# Altium project CONTROLLER.PrjPcb (part 1 of 2)
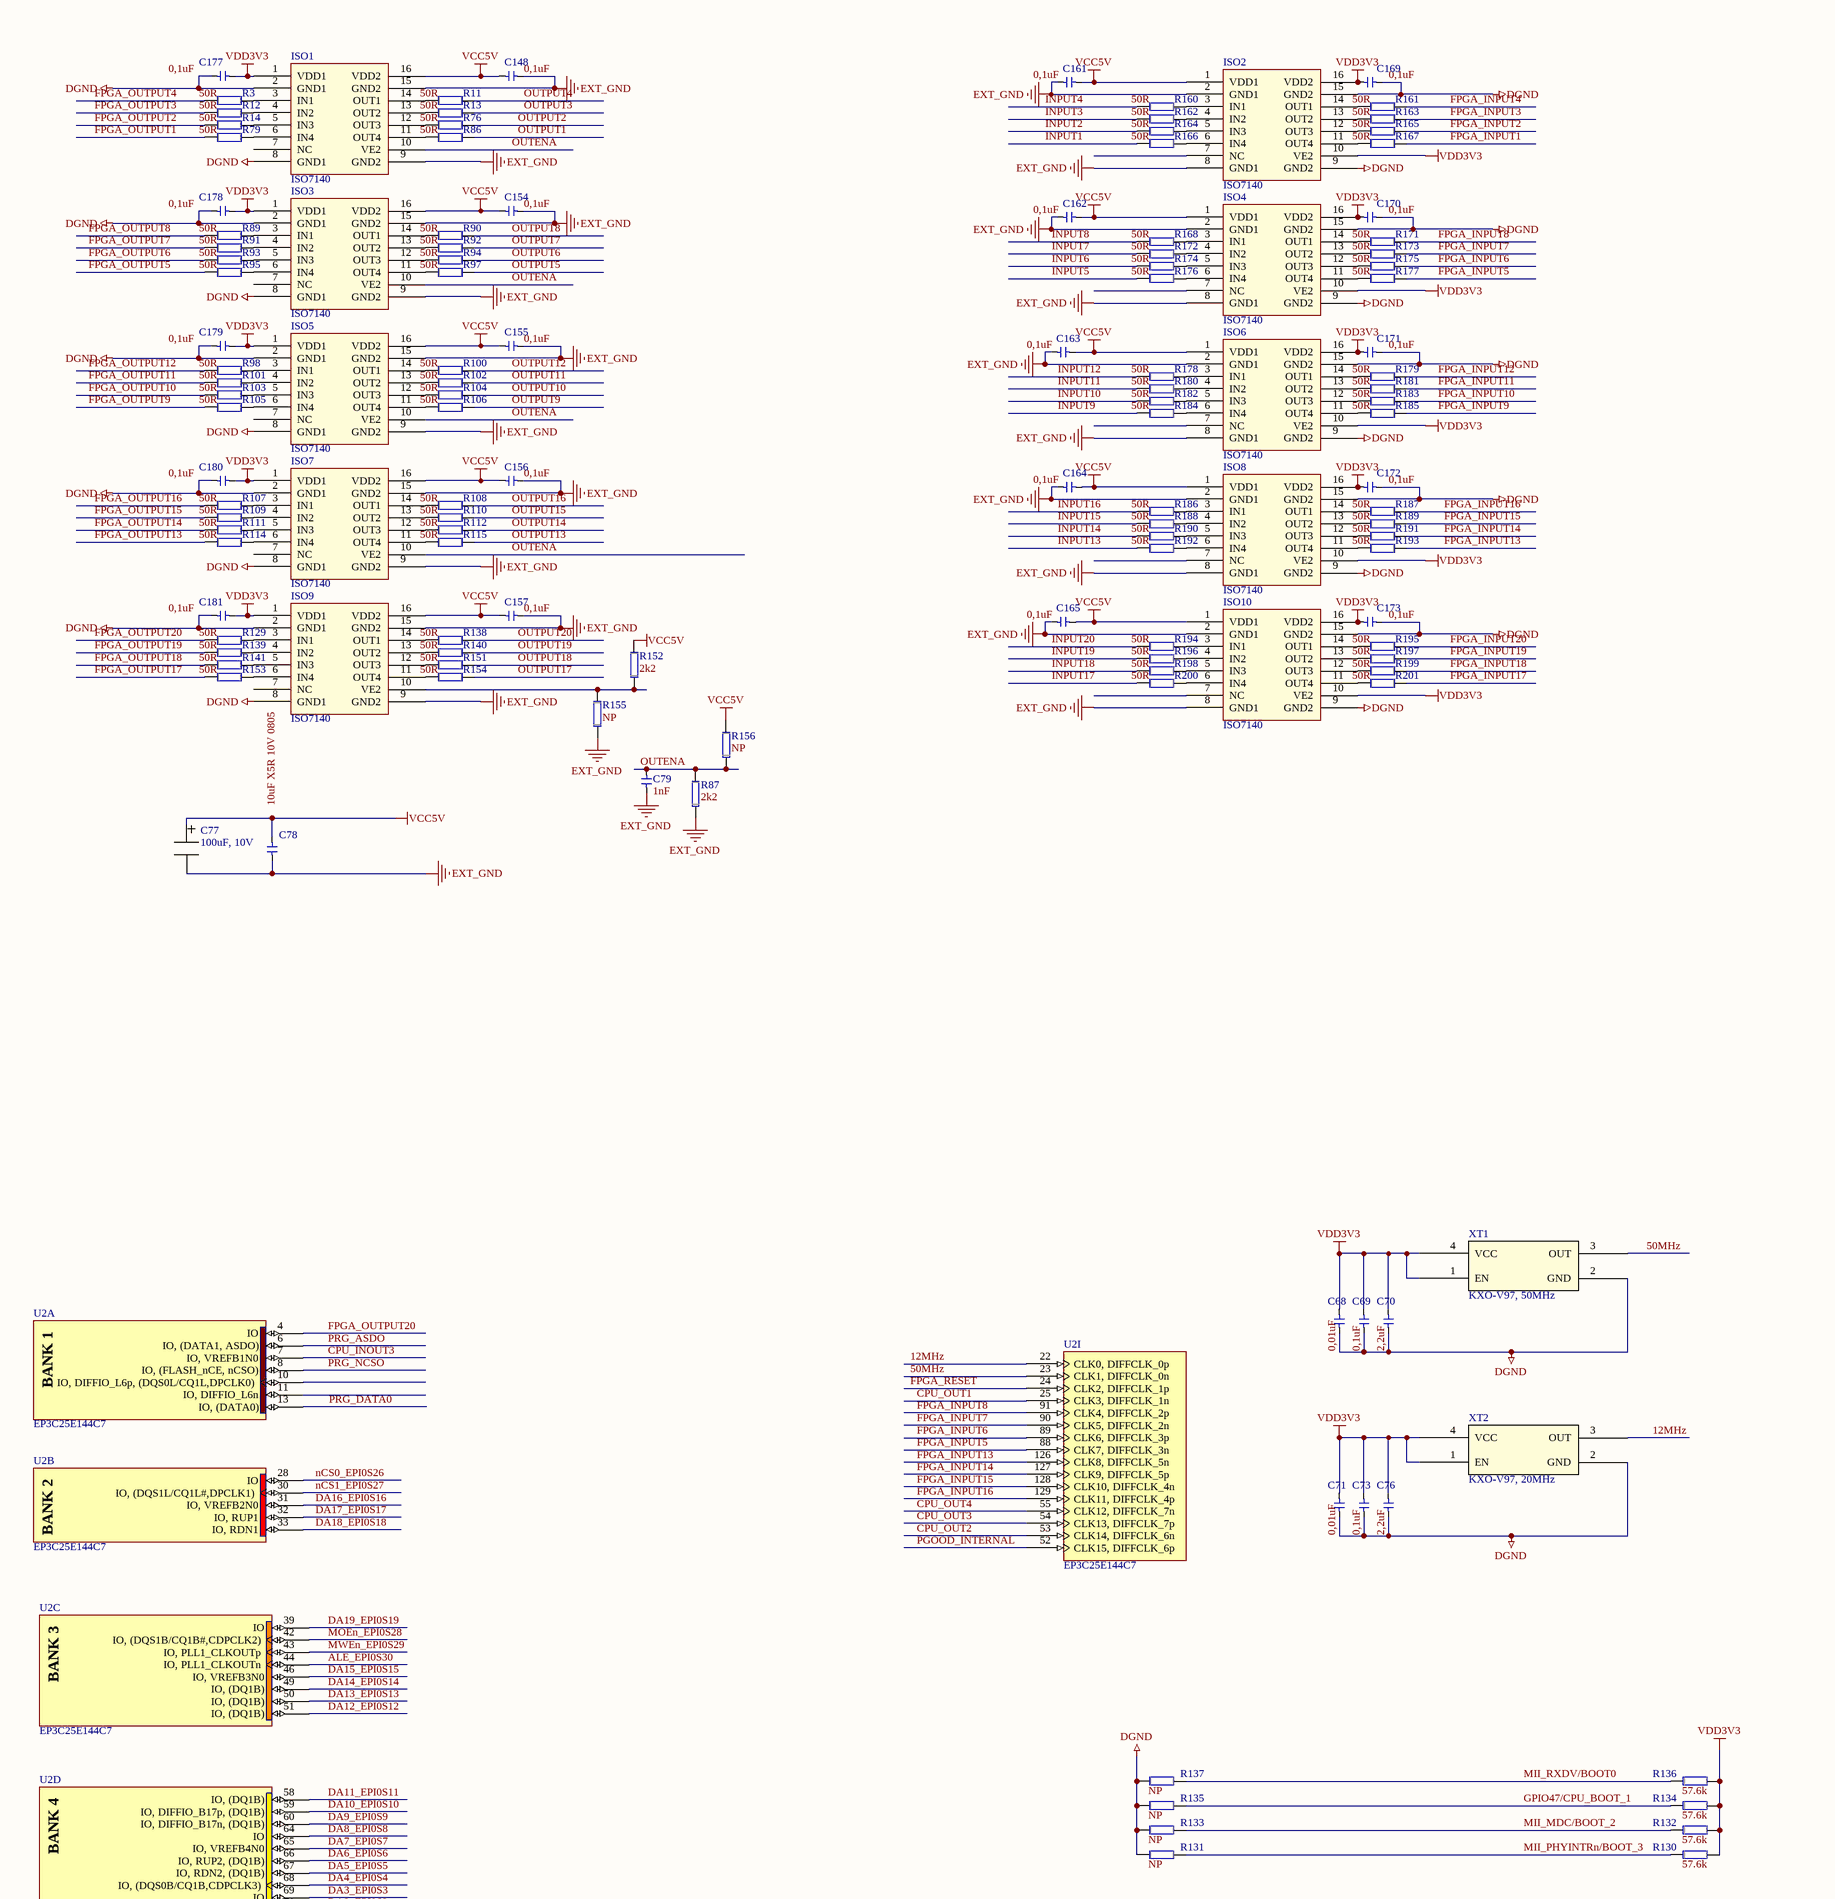
[diagram p0: CONTROLLER.SchDoc, top left]
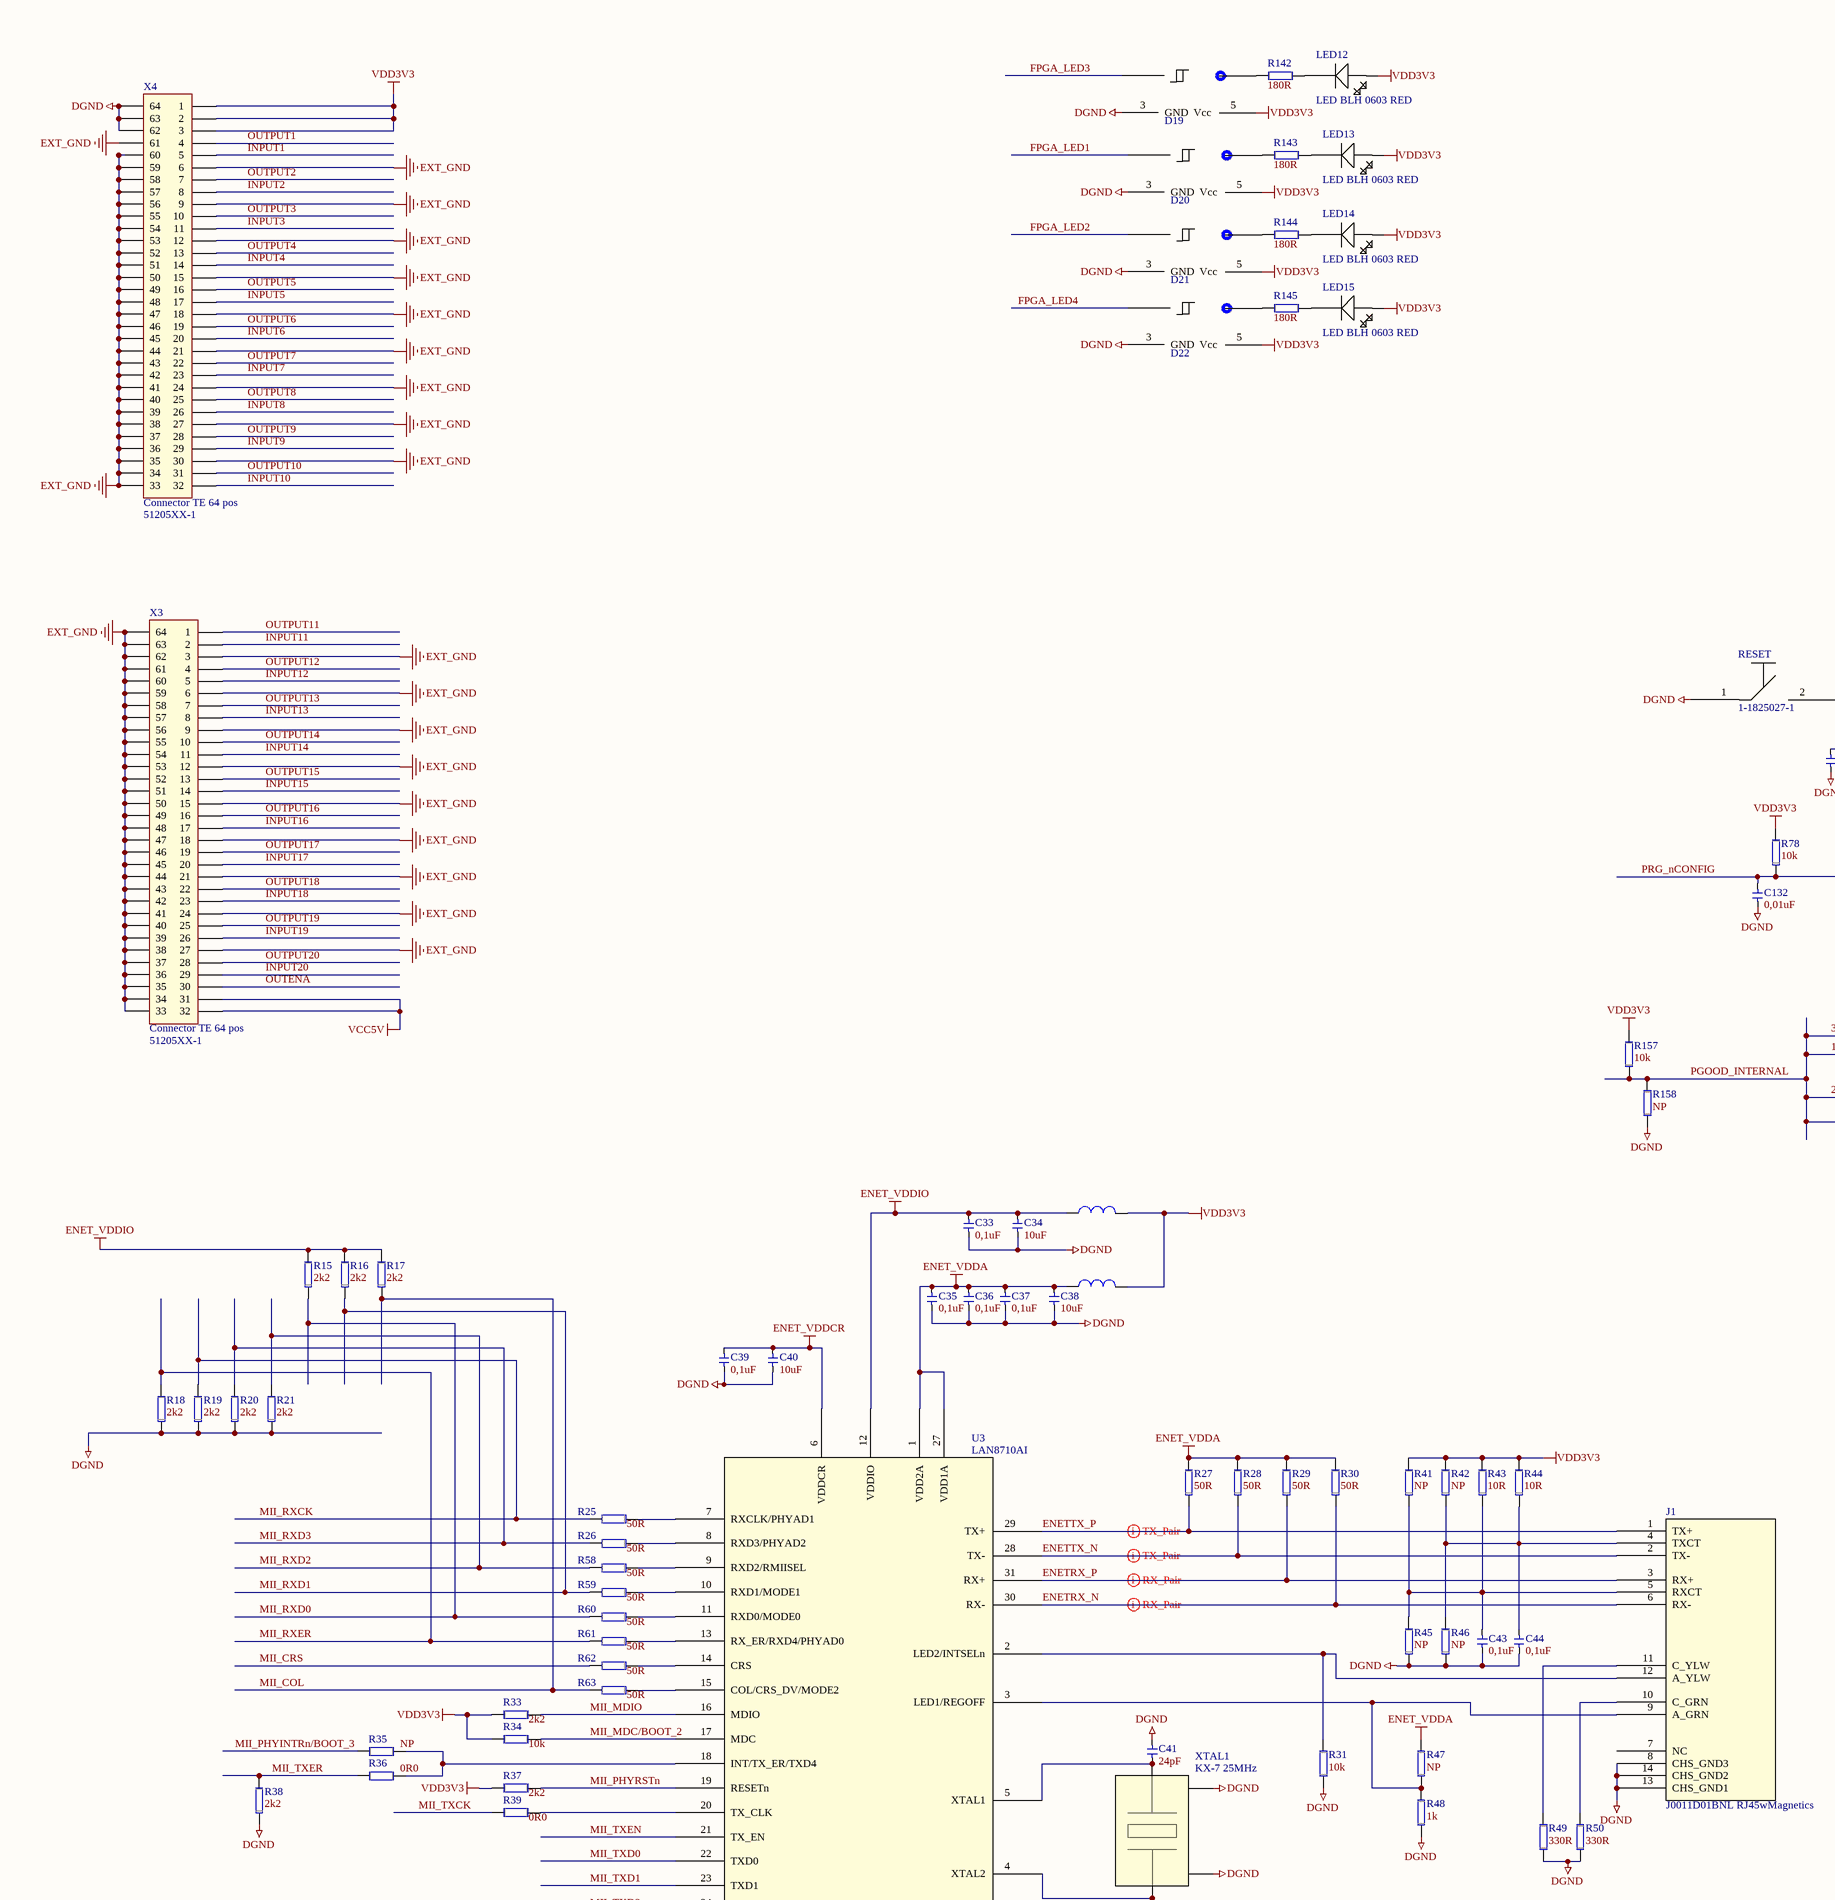
[diagram p1: CONTROLLER.SchDoc, top middle]
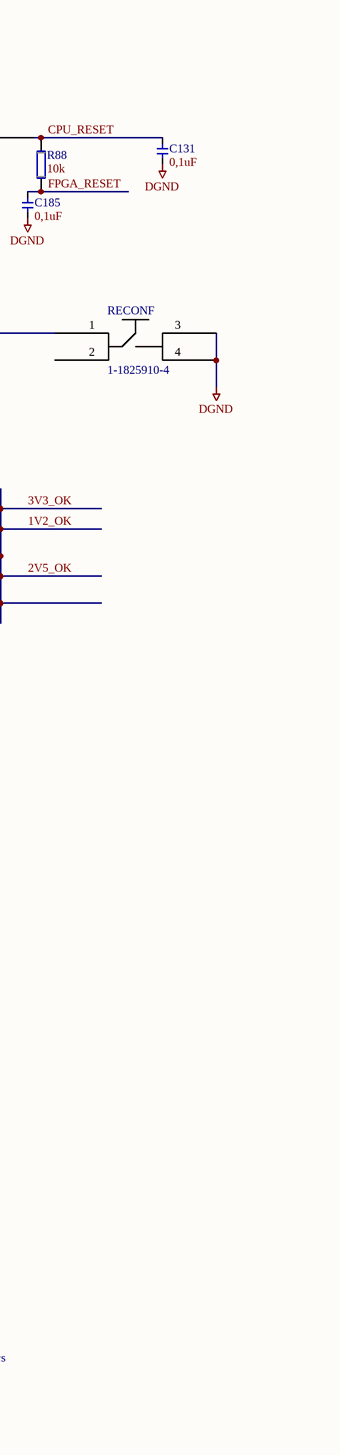
[diagram p2: CONTROLLER.SchDoc, top right]
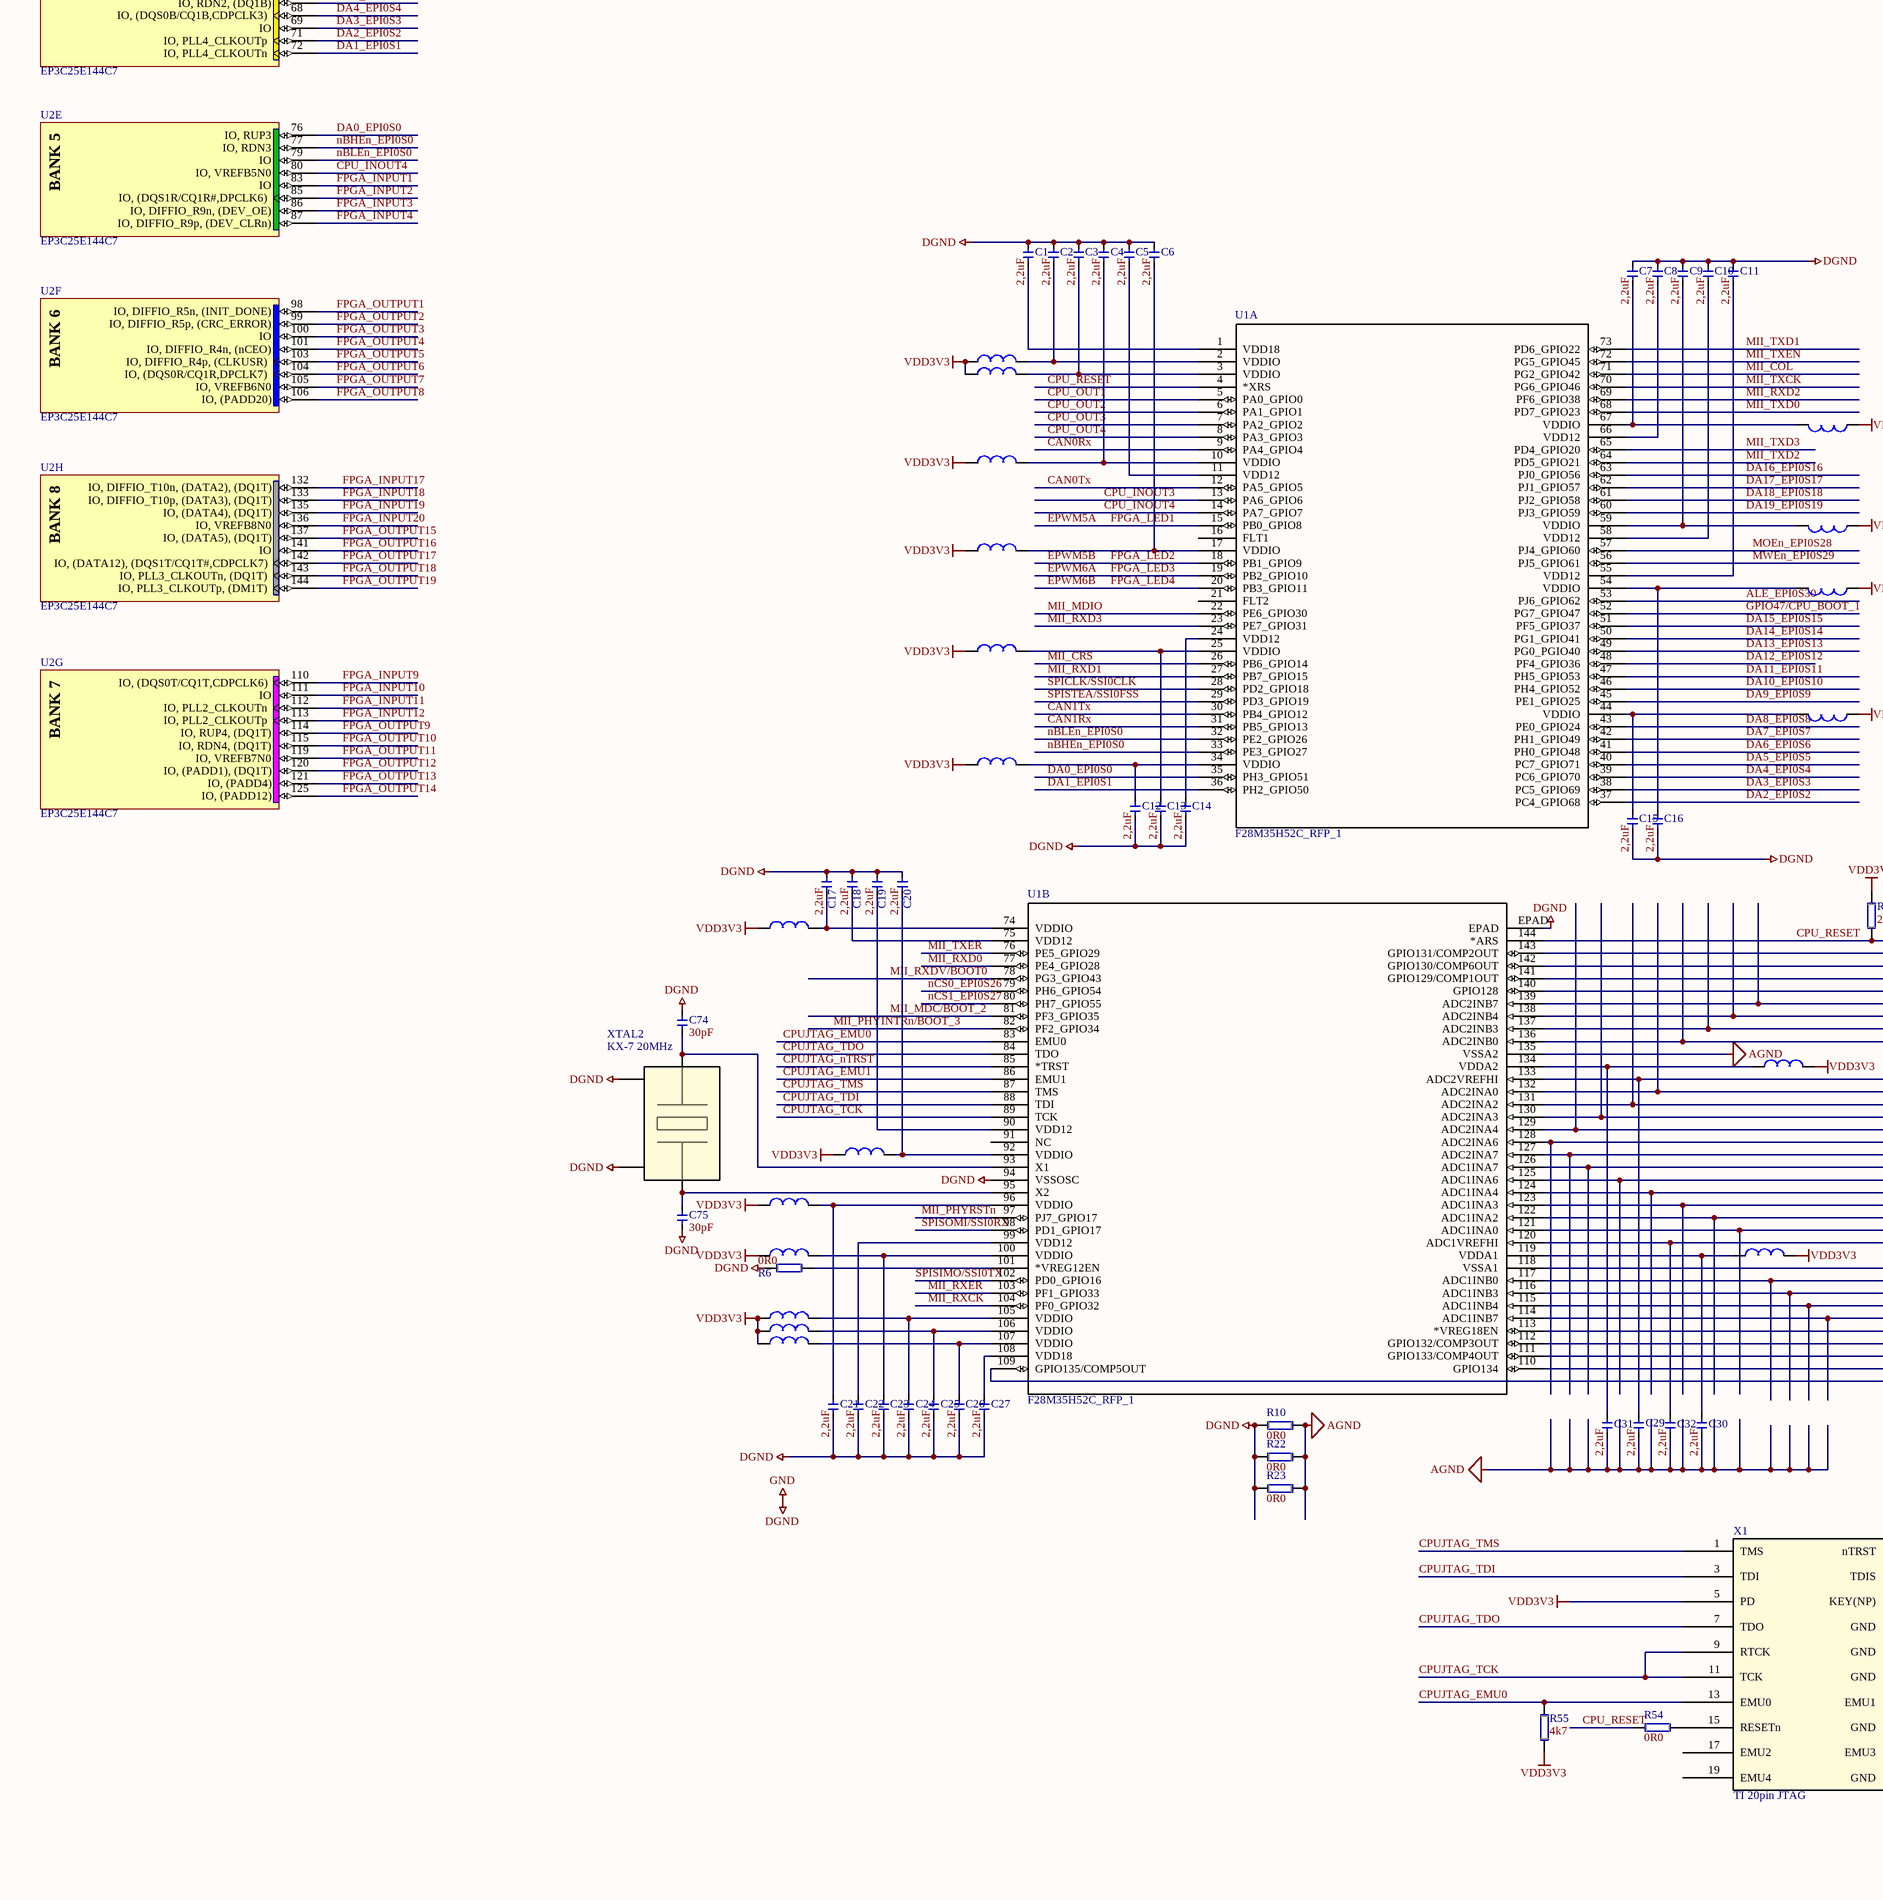
[diagram p3: CONTROLLER.SchDoc, bottom left]
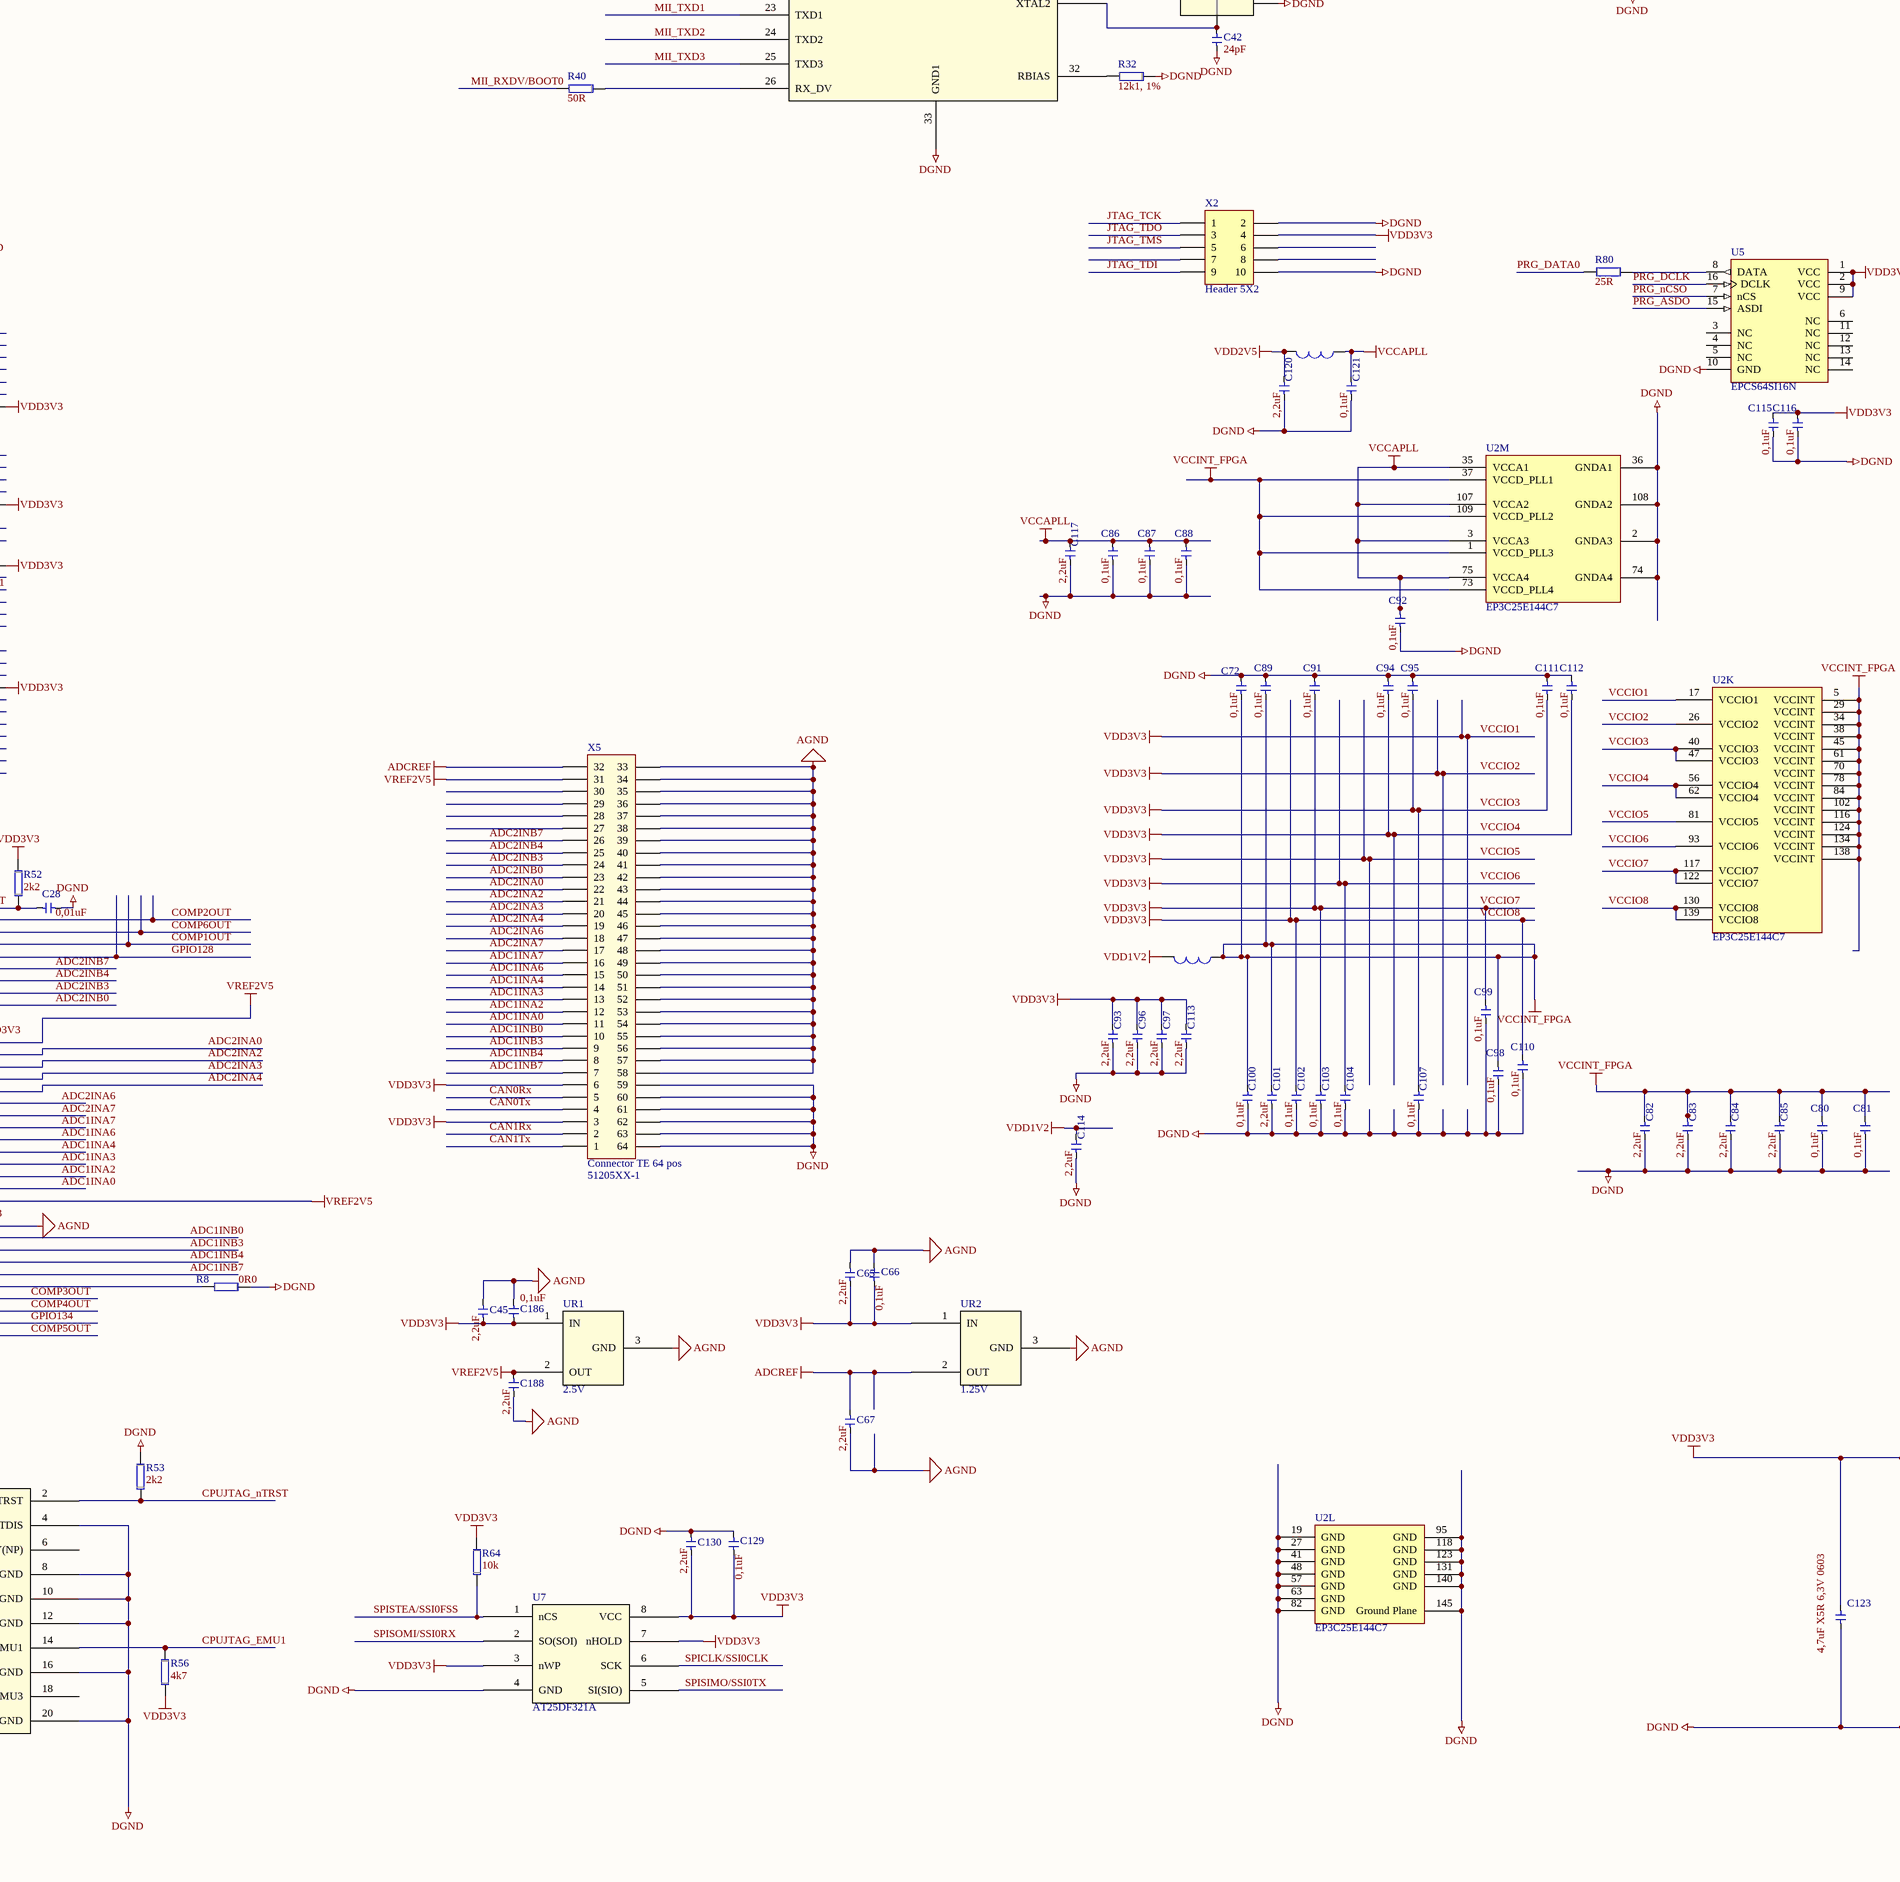
[diagram p4: CONTROLLER.SchDoc, bottom middle]
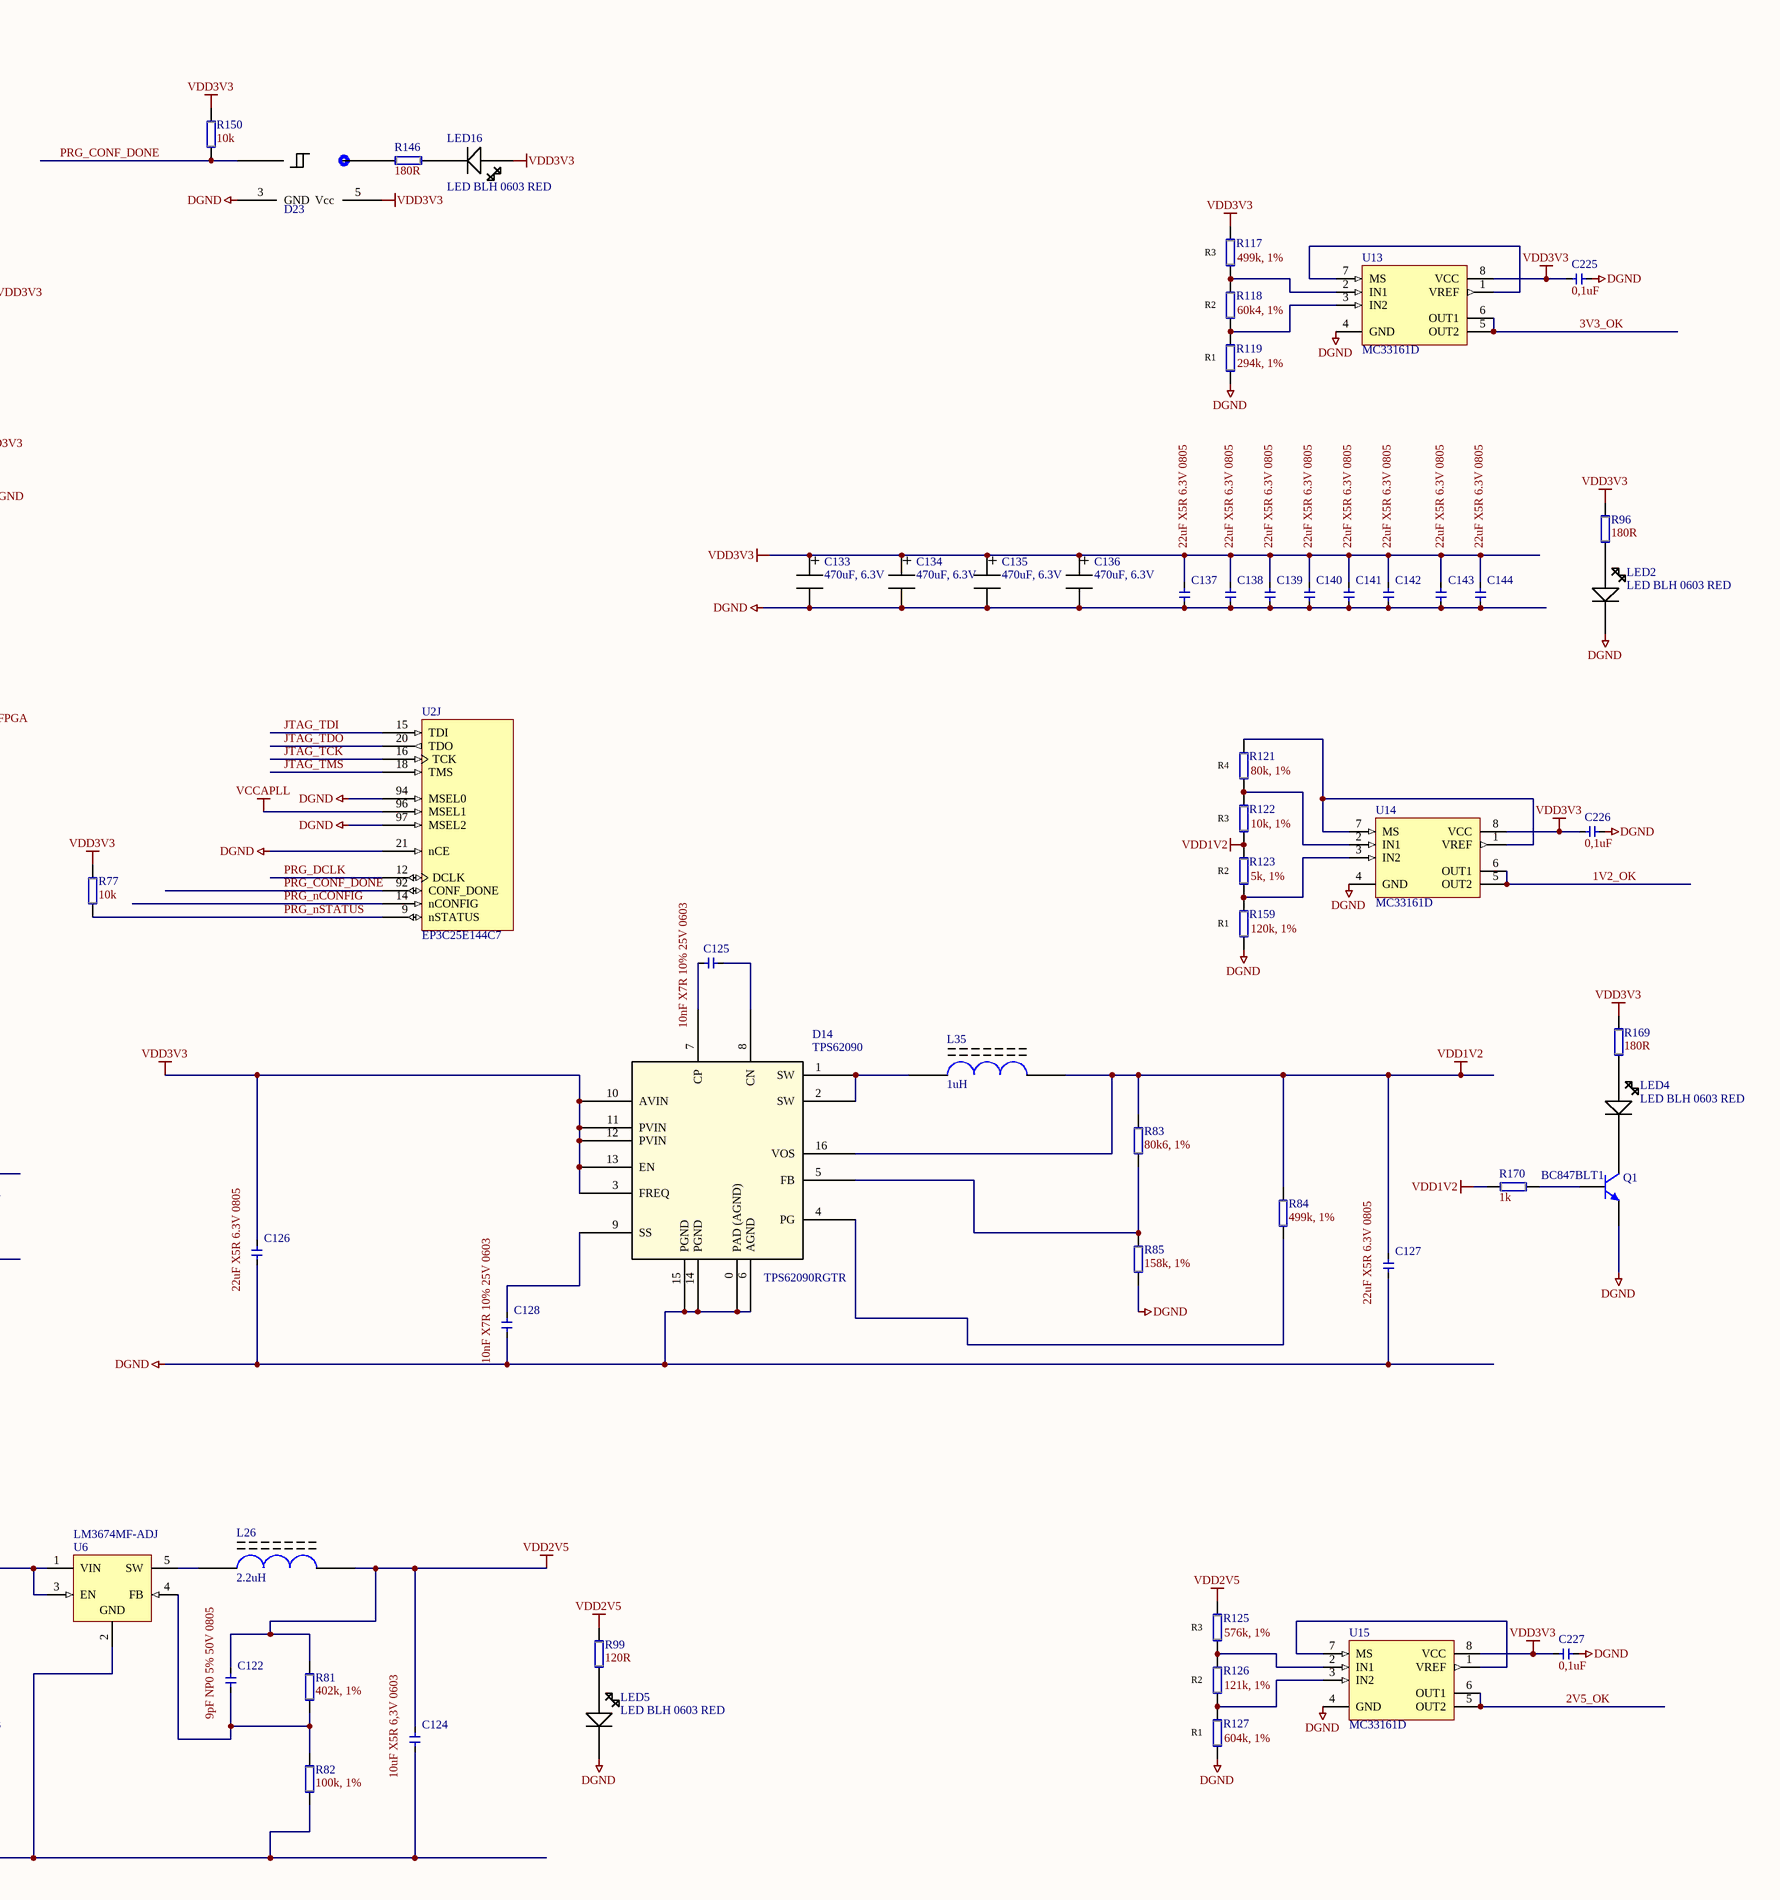
[diagram p5: CONTROLLER.SchDoc, bottom right]
1 sheet, 390 parts. Net scope: global (net labels, ports and power ports of the same name join across sheets).
Board file: CONTROLLER.PcbDoc